# Altium schematic sheet 01-Power.SchDoc
size A
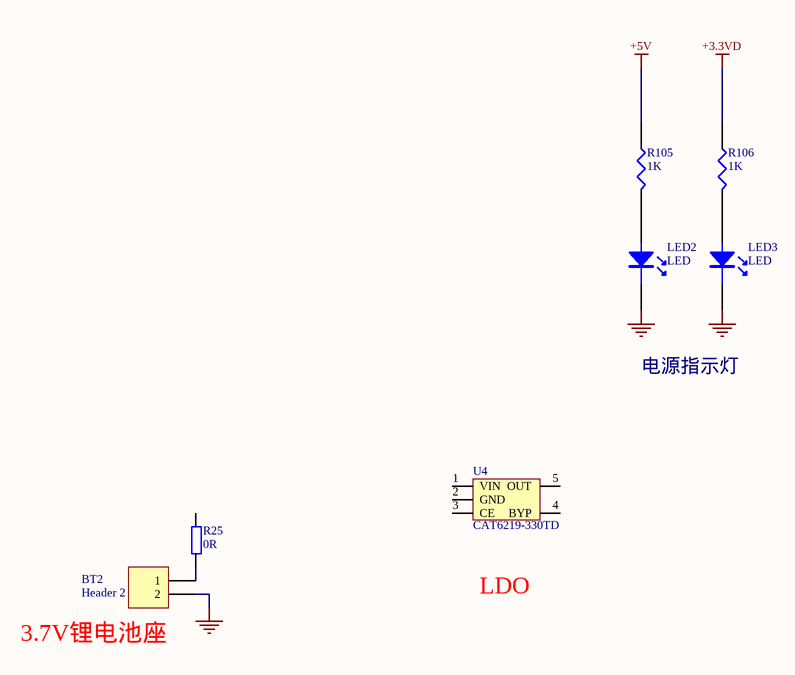
[diagram p0: 01-Power.SchDoc]

## Parts
BT2  Header 2  [HDR1X2]
LED2  LED  [LED0805]
LED3  LED  [LED0805]
R25  0R  [0603]
R105  1K  [0805]
R106  1K  [0805]
U4  CAT6219-330TD  [SOT-23-5]

## Nets
+3.3VD: R106.1
+5V: R105.1
DGND: BT2.2 LED2.2(K) LED3.2(K)
NetBT2_1: BT2.1 R25.1
NetLED2_1: LED2.1(A) R105.2
NetLED3_1: LED3.1(A) R106.2

Not connected (* = marked no-connect by the designer): R25 2; U4 1(VIN) 2(GND) 3(CE) 4(BYP) 5(OUT)

## Notes on the sheet
- 电源指示灯
- 3.7V锂电池座
- LDO

## Library data of the parts
BT2 = Header 2: Header, 2-Pin; LatestRevisionDate: 17-Jul-2002; LatestRevisionNote: Re-released for DXP Platform.; Publisher: Altium Limited
R25 = R
R105 R106 = RES1
U4 = CAT6219-330TD: 3.3V 500mA LDO